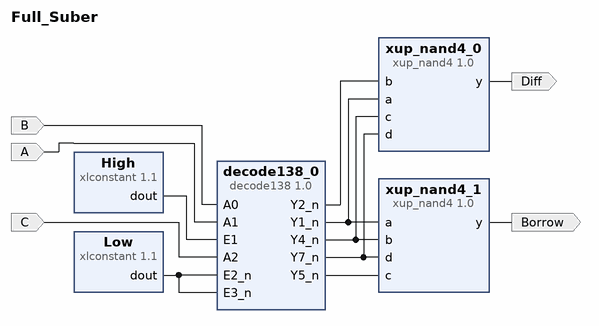
[diagram p0: block diagram of the top level]
# Vivado block design Full_Suber, xc7a35tcpg236-1, Vivado 2018.3
create_bd_design Full_Suber

create_bd_port -dir I B
create_bd_port -dir I A
create_bd_port -dir I C
create_bd_port -dir O Borrow
create_bd_port -dir O Diff

create_bd_cell -type ip -vlnv xilinx.com:XUP:decode138:1.0 decode138_0
create_bd_cell -type ip -vlnv xilinx.com:ip:xlconstant:1.1 Low
set_property -dict {CONFIG.CONST_VAL 0} [get_bd_cells Low]
create_bd_cell -type ip -vlnv xilinx.com:ip:xlconstant:1.1 High
create_bd_cell -type ip -vlnv xilinx.com:xup:xup_nand4:1.0 xup_nand4_0
create_bd_cell -type ip -vlnv xilinx.com:xup:xup_nand4:1.0 xup_nand4_1

# ---- connections ----

connect_bd_net -net A0_0_1 [get_bd_ports B] [get_bd_pins decode138_0/A0]
connect_bd_net -net A1_0_1 [get_bd_ports A] [get_bd_pins decode138_0/A1]
connect_bd_net -net A2_0_1 [get_bd_ports C] [get_bd_pins decode138_0/A2]
connect_bd_net -net xlconstant_1_dout [get_bd_pins High/dout] [get_bd_pins decode138_0/E1]
connect_bd_net -net xlconstant_0_dout [get_bd_pins Low/dout] [get_bd_pins decode138_0/E3_n] [get_bd_pins decode138_0/E2_n]
connect_bd_net [get_bd_pins decode138_0/Y1_n] [get_bd_pins xup_nand4_0/a] [get_bd_pins xup_nand4_1/a]
connect_bd_net [get_bd_pins decode138_0/Y2_n] [get_bd_pins xup_nand4_0/b]
connect_bd_net [get_bd_pins decode138_0/Y4_n] [get_bd_pins xup_nand4_0/c] [get_bd_pins xup_nand4_1/b]
connect_bd_net [get_bd_pins decode138_0/Y7_n] [get_bd_pins xup_nand4_0/d] [get_bd_pins xup_nand4_1/d]
connect_bd_net [get_bd_pins decode138_0/Y5_n] [get_bd_pins xup_nand4_1/c]
connect_bd_net [get_bd_pins xup_nand4_1/y] [get_bd_ports Borrow]
connect_bd_net [get_bd_pins xup_nand4_0/y] [get_bd_ports Diff]

validate_bd_design
save_bd_design
